# Altium schematic sheet LED Bank.SchDoc
size A4; DocumentNumber: 4; SheetNumber: 4; SheetTotal: 4
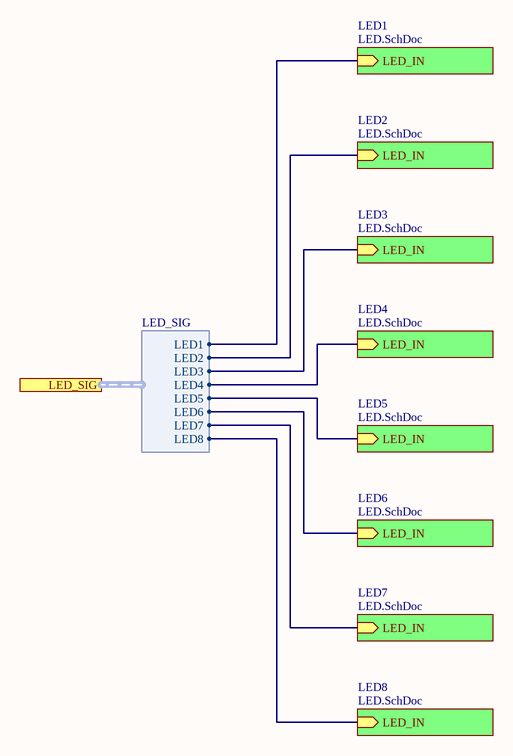
[diagram p0: LED Bank.SchDoc]

## Sub-sheets
LED1 = LED.SchDoc: LED_IN (in)
LED2 = LED.SchDoc: LED_IN (in)
LED3 = LED.SchDoc: LED_IN (in)
LED4 = LED.SchDoc: LED_IN (in)
LED5 = LED.SchDoc: LED_IN (in)
LED6 = LED.SchDoc: LED_IN (in)
LED7 = LED.SchDoc: LED_IN (in)
LED8 = LED.SchDoc: LED_IN (in)

## Ports
LED_SIG (harness LED_SIG)

## Harnesses
LED_SIG: LED1, LED2, LED3, LED4, LED5, LED6, LED7, LED8

## Nets
(unnamed): sheet LED1/LED_IN, port LED_SIG.LED1
(unnamed): sheet LED2/LED_IN, port LED_SIG.LED2
(unnamed): sheet LED3/LED_IN, port LED_SIG.LED3
(unnamed): sheet LED4/LED_IN, port LED_SIG.LED4
(unnamed): sheet LED5/LED_IN, port LED_SIG.LED5
(unnamed): sheet LED6/LED_IN, port LED_SIG.LED6
(unnamed): sheet LED7/LED_IN, port LED_SIG.LED7
(unnamed): sheet LED8/LED_IN, port LED_SIG.LED8